# EAGLE schematic v3sch (EAGLE 7.5.0)
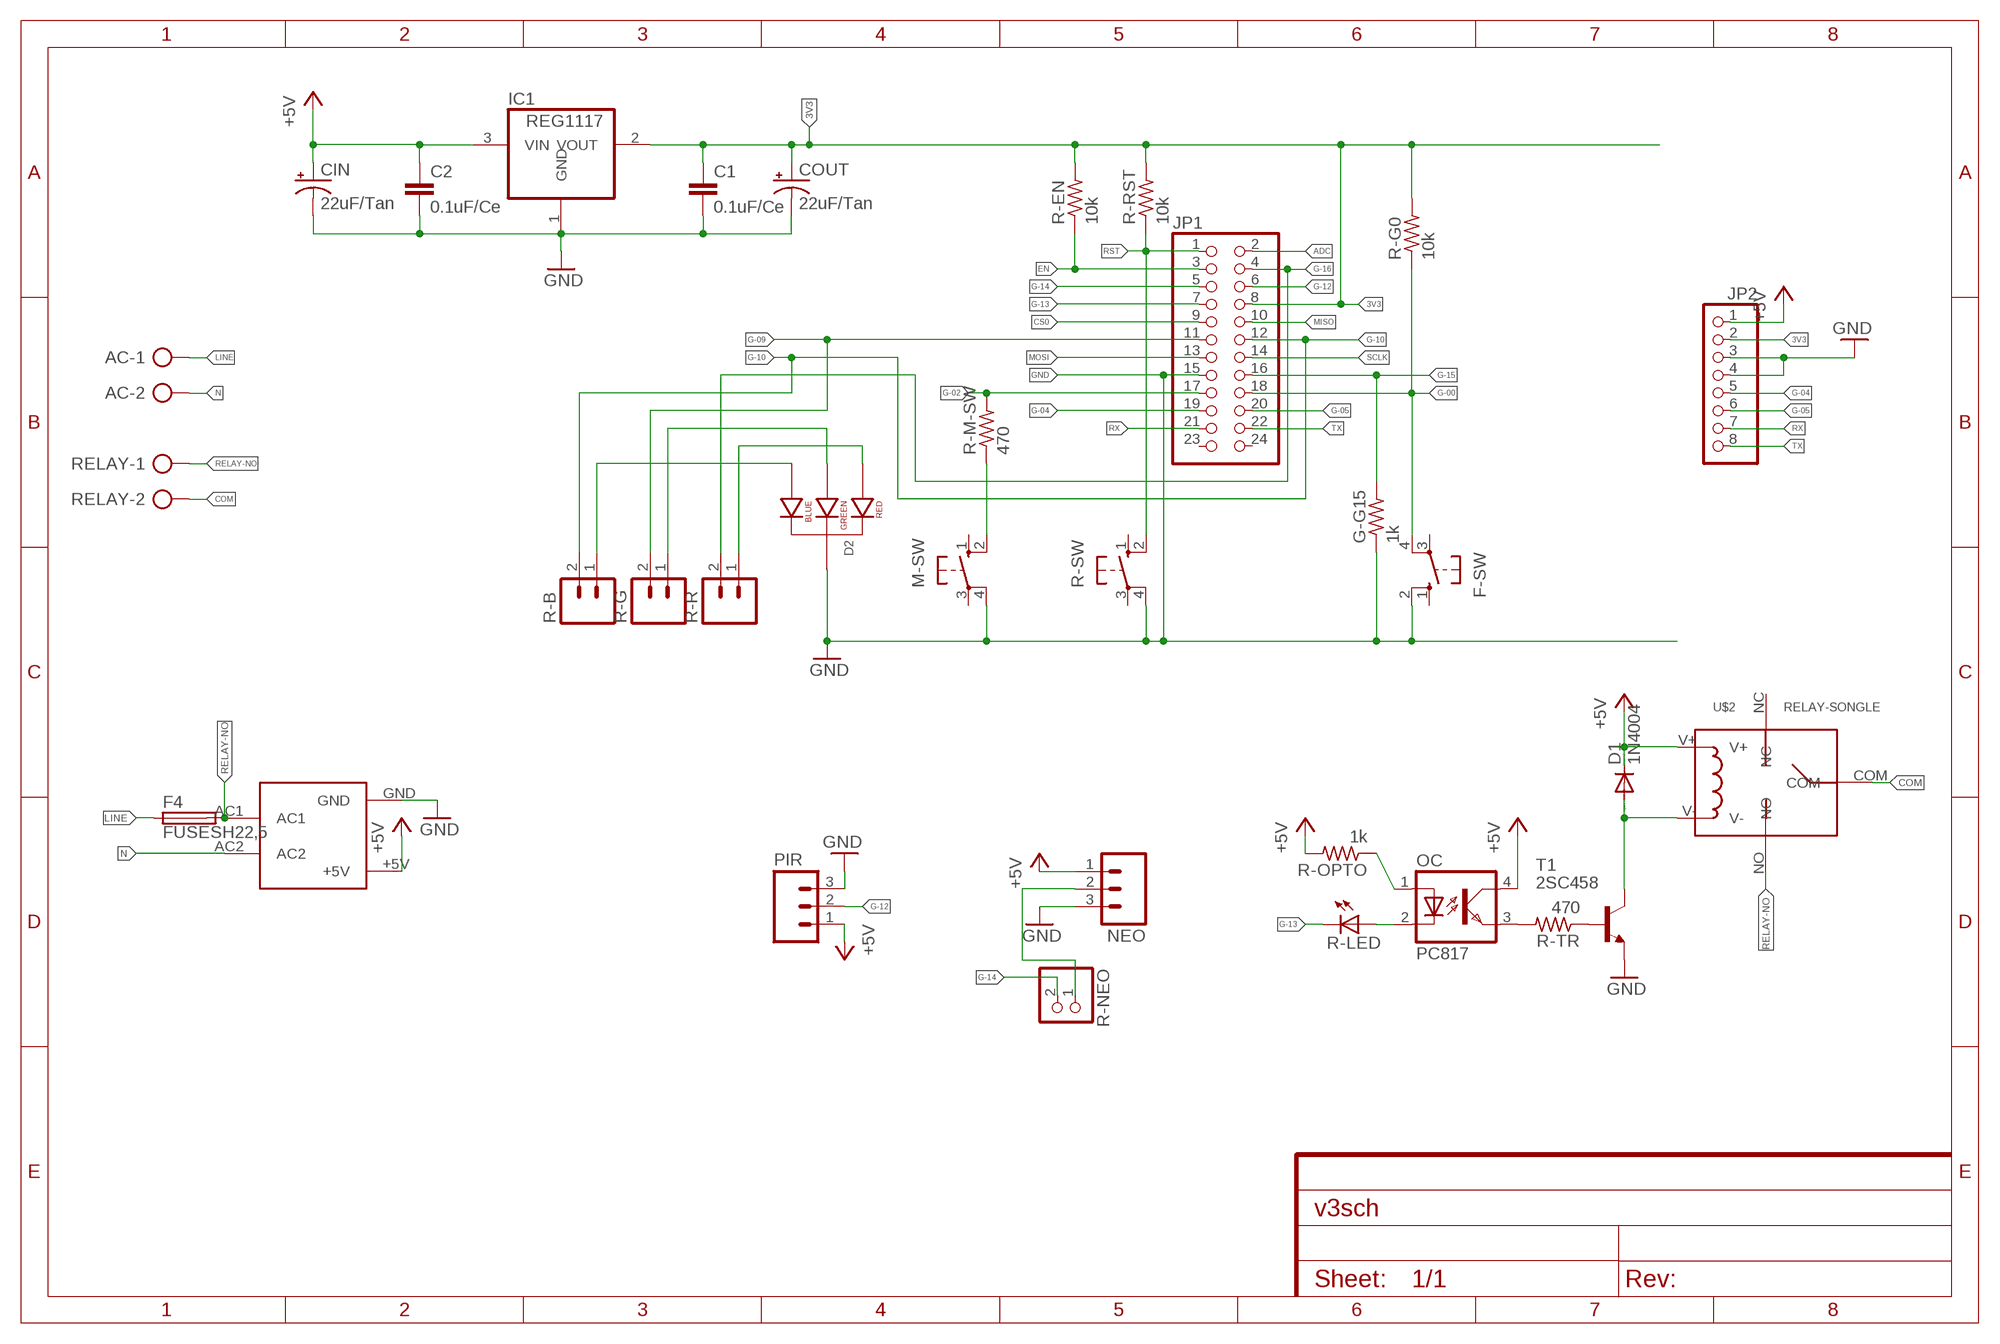
[diagram p0: schematic, sheet 1]

## Parts
AC  AK300/2  [AK300/2]
C1  0.1uF/Ce  C-EU025-024X044  [C025-024X044]
C2  0.1uF/Ce  C-EU025-024X044  [C025-024X044]
CIN  22uF/Tan  CPOL-USE2.5-5  [E2,5-5]
COUT  22uF/Tan  CPOL-USE2.5-5  [E2,5-5]
D1  1N4004  [DO41-10]
D2  LED-RGB-CC-THRU  [LED-RGB-THRU]
F4  FUSESH22,5  [SH22,5]
F-SW  10-XX  [B3F-10XX]
G-G15  1k  R-US_0204/5  [0204/5]
IC1  REG1117  [SOT223]
JP1  PINHD-2X12  [2X12]
JP2  PINHD-1X8  [1X08]
M-SW  10-XX  [B3F-10XX]
NEO  M03POLAR  [MOLEX-1X3]
OC  PC817  [DIL04]
PIR  M03POLAR  [MOLEX-1X3]
R-B  M02PTH  [1X02]
R-EN  10k  R-US_0204/5  [0204/5]
R-G  M02PTH  [1X02]
R-G0  10k  R-US_0204/5  [0204/5]
R-LED  LED3MM  [LED3MM]
R-M-SW  470  R-US_0204/5  [0204/5]
R-NEO  PINHD-1X2  [1X02]
R-OPTO  1k  R-US_0204/5  [0204/5]
R-R  M02PTH  [1X02]
R-RST  10k  R-US_0204/5  [0204/5]
R-SW  10-XX  [B3F-10XX]
R-TR  470  R-US_0204/5  [0204/5]
RELAY  AK300/2  [AK300/2]
T1  2SC458  [TO92-ECB]
U$1  HLK-PM01  [HLK-PM01]
U$2  RELAY-SONGLE  [RELAY-SONGLE]

## Nets
3V3: C1.1 COUT.+ IC1.2(VOUT) JP1.8 JP2.2 R-EN.2 R-G0.2 R-RST.2
+5V: C2.1 CIN.+ D1.C IC1.3(VIN) JP2.1 NEO.1 OC.4(COL) PIR.1 R-OPTO.2 U$1.+5V U$2.V+
ADC: JP1.2
COM: RELAY.2 U$2.COM
CS0: JP1.9
EN: JP1.3 R-EN.1
G-00: F-SW.4(P1) JP1.18 R-G0.1
G-02: JP1.17 R-M-SW.2
G-04: JP1.19 JP2.5
G-05: JP1.20 JP2.6
G-09: JP1.11 R-G.2
G-10: JP1.12 R-B.2
G-12: JP1.6 PIR.2
G-13: JP1.7 R-LED.K(C)
G-14: JP1.5 R-NEO.2
G-15: G-G15.2 JP1.16
G-16: JP1.4 R-R.2
GND: C1.2 C2.2 CIN.- COUT.- D2.P$2(CATHODE) F-SW.2(S1) G-G15.1 IC1.1(GND) JP1.15 JP2.3 JP2.4 M-SW.4(P1) NEO.3 PIR.3 R-SW.4(P1) T1.E U$1.GND
LINE: AC.1 F4.1
MISO: JP1.10
MOSI: JP1.13
N: AC.2 U$1.AC2
N$1: OC.3(EMIT) R-TR.2
N$2: R-TR.1 T1.B
N$3: D2.P$1(RED_CATHODE) R-R.1
N$4: D2.P$3(GREEN_CATHODE) R-G.1
N$5: D2.P$4(BLUE_CATHODE) R-B.1
N$6: OC.2(C) R-LED.A
N$7: NEO.2 R-NEO.1
N$11: M-SW.2(S1) R-M-SW.1
N$13: OC.1(A) R-OPTO.1
N$18: D1.A T1.C U$2.V-
RELAY-NO: F4.2 RELAY.1 U$1.AC1 U$2.NO
RST: JP1.1 R-RST.1 R-SW.2(S1)
RX: JP1.21 JP2.7
SCLK: JP1.14
TX: JP1.22 JP2.8
Unconnected: F-SW.1(S) F-SW.3(P) JP1.23 JP1.24 M-SW.1(S) M-SW.3(P) R-SW.1(S) R-SW.3(P) U$2.NC

## Library data of the parts
AC RELAY = con-ptr500:AK300/2: CONNECTOR; OC_FARNELL: unknown; OC_NEWARK: unknown
C1 C2 = rcl:C-EU: CAPACITOR, European symbol
CIN COUT = rcl:CPOL-US: POLARIZED CAPACITOR, American symbol
D1 = diode:1N4004: DIODE general purpose rectifier, 1 A
D2 = SparkFun-LED-RGB-Tong:LED-RGB-CC-THRU: RGB Through-hole common cathode LED SparkFun Storefront: COM-00105 (Clear) COM-09264 (Diffuse)
F4 = fuse:FUSE: Fuse; OC_FARNELL: unknown; OC_NEWARK: unknown
F-SW M-SW R-SW = switch-omron:10-XX: OMRON SWITCH; MPN: B3F-1000; OC_FARNELL: 176432; OC_NEWARK: 36M3542
G-G15 R-EN R-G0 R-M-SW R-OPTO R-RST R-TR = rcl:R-US_: RESISTOR, American symbol
IC1 = burr-brown:REG1117: 800mA and 1A Low Dropout (LDO) Positive Regulator 1.8V, 2.5V, 2.85V, 3.3V, 5V, and Adj; MPN: REG1117; OC_FARNELL: 1097566; OC_NEWARK: 14P6981
JP1 = pinhead:PINHD-2X12: PIN HEADER
JP2 = pinhead:PINHD-1X8: PIN HEADER
NEO PIR = SparkFun-Connectors:M03: Header 3 Standard 3-pin 0.1" header. Use with straight break away headers (SKU : PRT-00116), right angle break away headers (PRT-00553), swiss pins (PRT-00743), machine pins (PRT-00117), and female headers (PRT-00115). Molex polarized connector foot print use with SKU : PRT-08232 with associated crimp pins and housings.
OC = optocoupler:PC817: SHARP OPTO COUPLER; MPN: PC817X4J000F; OC_FARNELL: 9707727; OC_NEWARK: 97K7059
R-B R-G R-R = SparkFun-Connectors:M02: Standard 2-pin 0.1" header. Use with - straight break away headers ( PRT-00116) - right angle break away headers (PRT-00553) - swiss pins (PRT-00743) - machine pins (PRT-00117) - female headers (PRT-00115) Molex polarized connector foot print use with: PRT-08233 with associated crimp pins and housings. 2.54_SCREWTERM for use with PRT-10571. 3.5mm Screw Terminal footprints for PRT-08084 5mm Screw Terminal footprints for use with PRT-08432
R-LED = led:LED: LED OSRAM: - CHIPLED LG R971, LG N971, LY N971, LG Q971, LY Q971, LO R971, LY R971 LH N974, LH R974 LS Q976, LO Q976, LY Q976 LO Q996 - Hyper CHIPLED LW Q18S LB Q993, LB Q99A, LB R99A - SideLED LS A670, LO A670, LY A670, LG A670, LP A670 LB A673, LV A673, LT A673, LW A673 LH A674 LY A675 LS A676, LA A676, LO A676, LY A676, LW A676 LS A679, LY A679, LG A679 - Hyper Micro SIDELED® LS Y876, LA Y876, LO Y876, LY Y876 LT Y87S - SmartLED LW L88C, LW L88S LB L89C, LB L89S, LG L890 LS L89K, LO L89K, LY L89K LS L896, LA L896, LO L896, LY L896 - TOPLED LS T670, LO T670, LY T670, LG T670, LP T670 LSG T670, LSP T670, LSY T670, LOP T670, LYG T670 LG T671, LOG T671, LSG T671 LB T673, LV T673, LT T673, LW T673 LH T674 LS T676, LA T676, LO T676, LY T676, LB T676, LH T676, LSB T676, LW T676 LB T67C, LV T67C, LT T67C, LS T67K, LO T67K, LY T67K, LW E67C LS E67B, LA E67B, LO E67B, LY E67B, LB E67C, LV E67C, LT E67C LW T67C LS T679, LY T679, LG T679 LS T770, LO T770, LY T770, LG T770, LP T770 LB T773, LV T773, LT T773, LW T773 LH T774 LS E675, LA E675, LY E675, LS T675 LS T776, LA T776, LO T776, LY T776, LB T776 LHGB T686 LT T68C, LB T68C - Hyper Mini TOPLED® LB M676 - Mini TOPLED Santana® LG M470 LS M47K, LO M47K, LY M47K Source: http://www.osram.convergy.de LUXEON: - LUMILED® LXK2-PW12-R00, LXK2-PW12-S00, LXK2-PW14-U00, LXK2-PW14-V00 LXK2-PM12-R00, LXK2-PM12-S00, LXK2-PM14-U00 LXK2-PE12-Q00, LXK2-PE12-R00, LXK2-PE12-S00, LXK2-PE14-T00, LXK2-PE14-U00 LXK2-PB12-K00, LXK2-PB12-L00, LXK2-PB12-M00, LXK2-PB14-N00, LXK2-PB14-P00, LXK2-PB14-Q00 LXK2-PR12-L00, LXK2-PR12-M00, LXK2-PR14-Q00, LXK2-PR14-R00 LXK2-PD12-Q00, LXK2-PD12-R00, LXK2-PD12-S00 LXK2-PH12-R00, LXK2-PH12-S00 LXK2-PL12-P00, LXK2-PL12-Q00, LXK2-PL12-R00 Source: www.luxeon.com KINGBRIGHT: KA-3528ASYC Source: www.kingbright.com
R-NEO = pinhead:PINHD-1X2: PIN HEADER
T1 = transistor:2SC458: NPN Silicon Epitaxial Planar Transistor Source: SEMTECH ELECTRONICS LTD. ... 2SC458 1.pdf
U$1 = HLK-PM01:HLK-PM01
U$2 = Seeed-OPL-Relay:RELAY-SONGLE